# Altium schematic sheet icewerks.SchDoc
size C
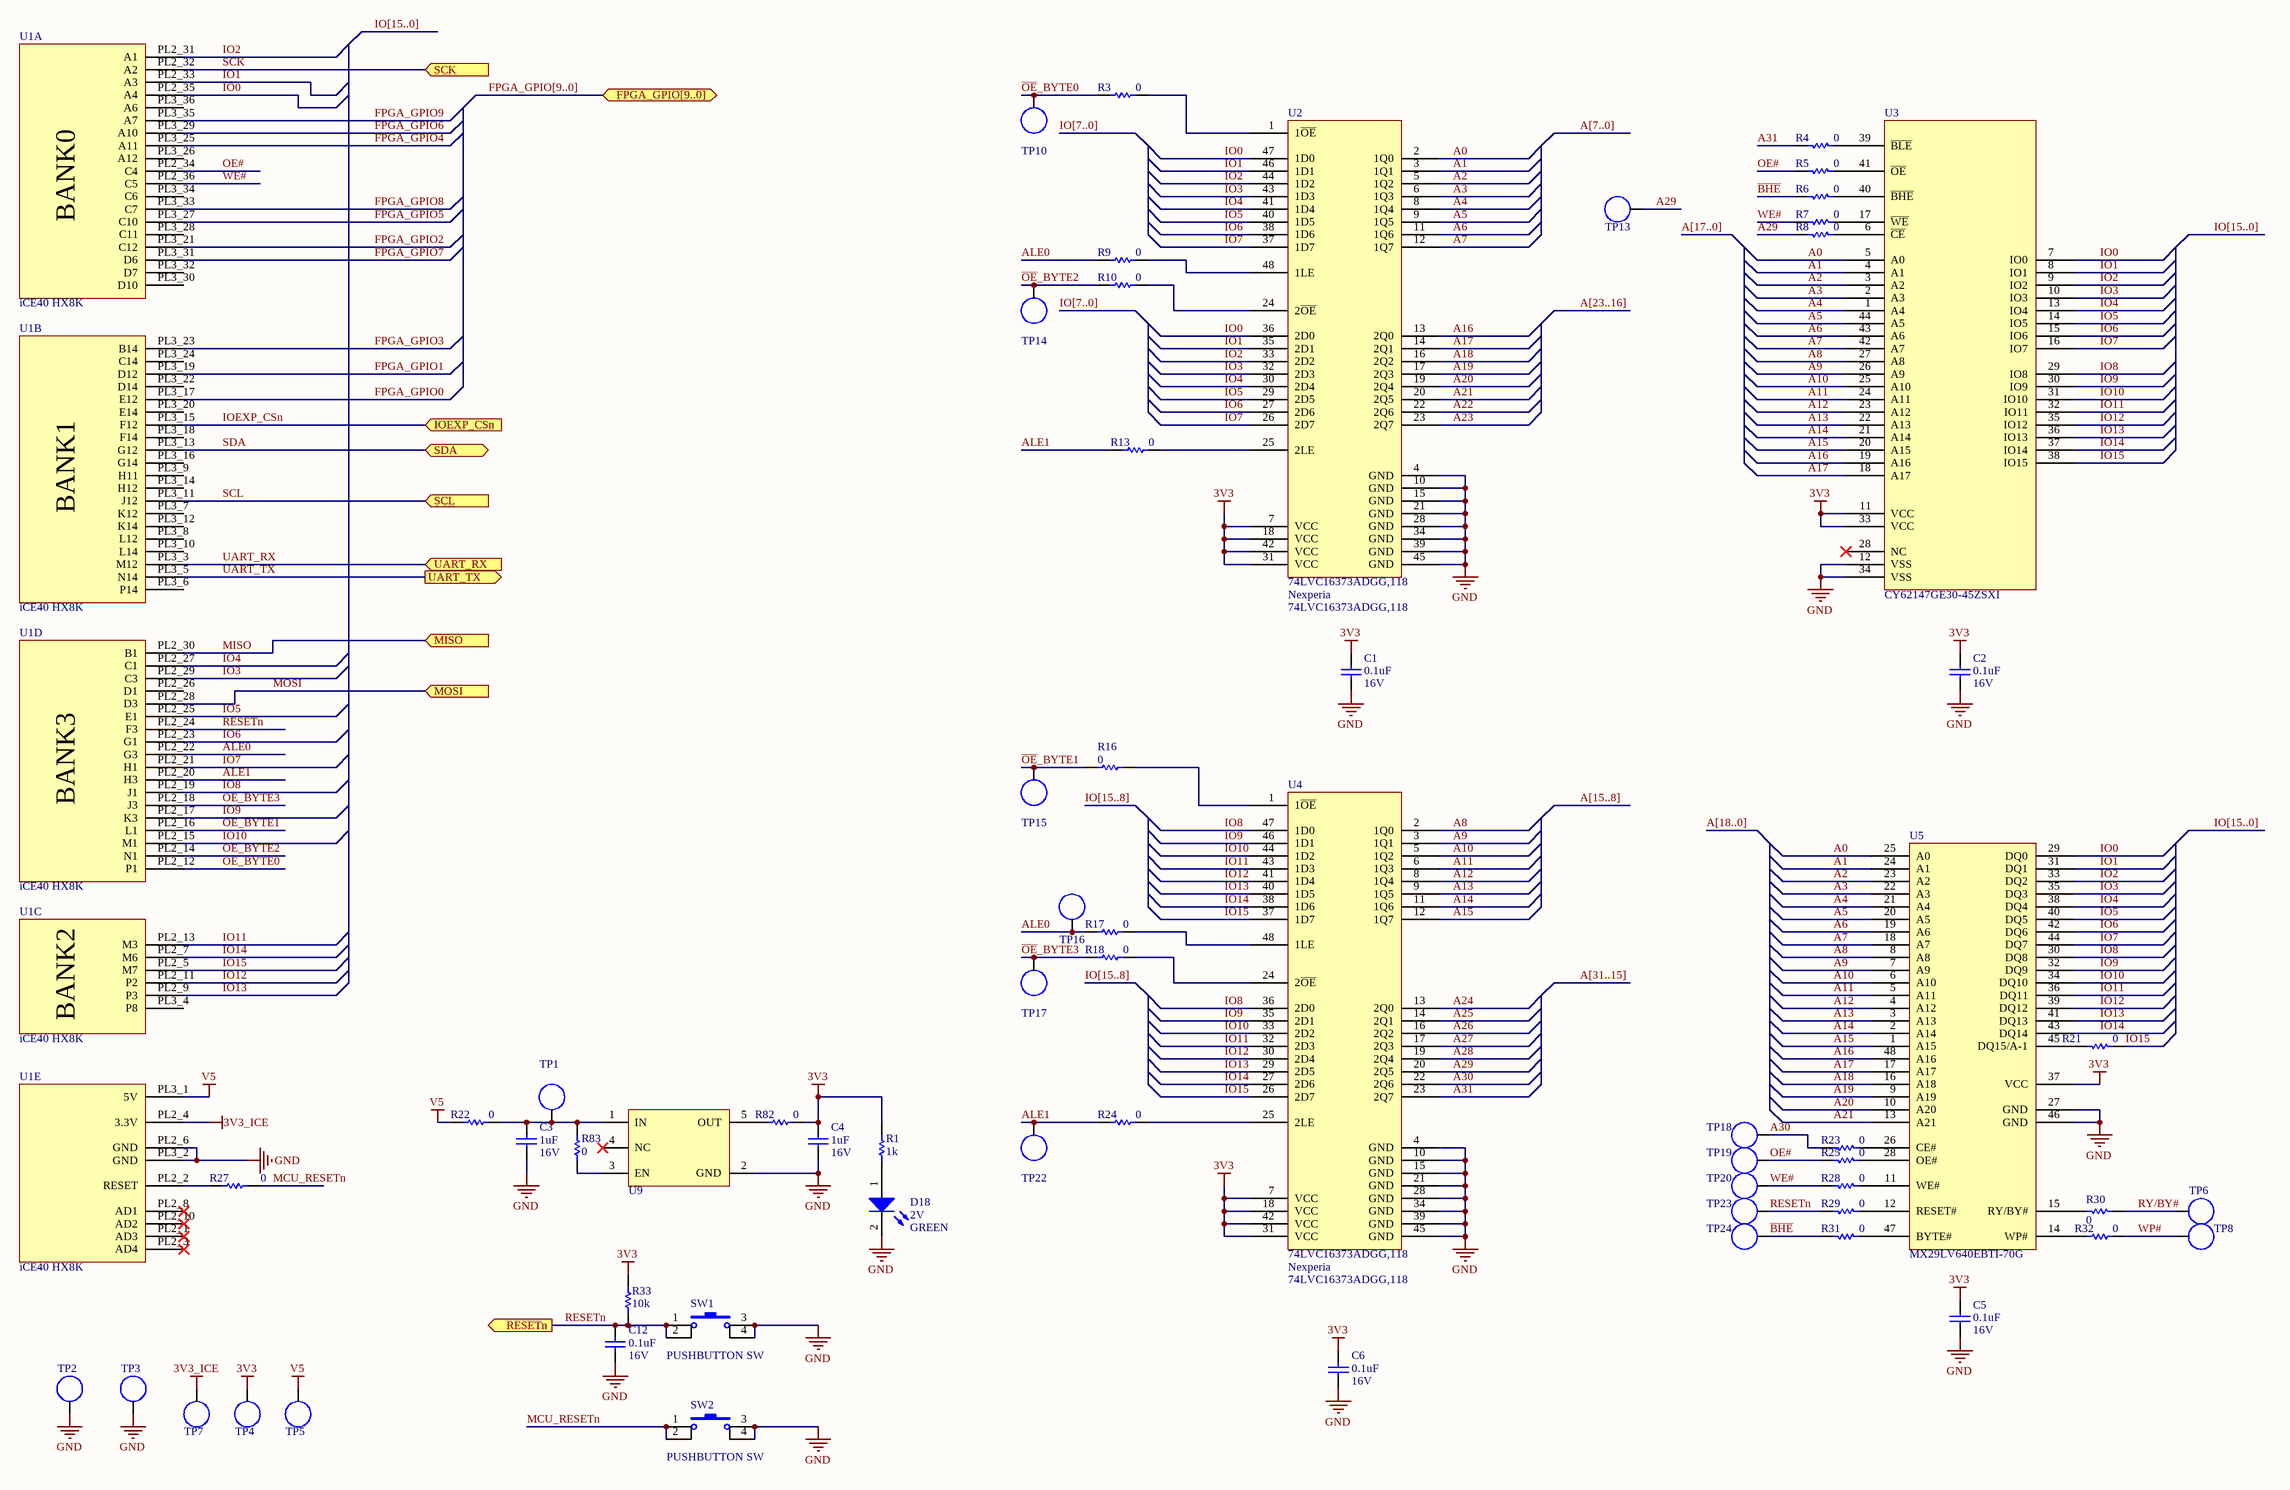
[diagram p0: icewerks.SchDoc]

## Parts
C1  Voltage: 16V  Capacitance: 0.1uF  [0805]  (hidden comment: Cap_NP)
C2  Voltage: 16V  Capacitance: 0.1uF  [0805]  (hidden comment: Cap_NP)
C3  Voltage: 16V  Capacitance: 1uF  [0805]  (hidden comment: Cap_NP)
C4  Voltage: 16V  Capacitance: 1uF  [0805]  (hidden comment: Cap_NP)
C5  Voltage: 16V  Capacitance: 0.1uF  [0805]  (hidden comment: Cap_NP)
C6  Voltage: 16V  Capacitance: 0.1uF  [0805]  (hidden comment: Cap_NP)
C12  Voltage: 16V  Capacitance: 0.1uF  [0805]  (hidden comment: Cap_NP)
D18  Vf: 2V  Color: GREEN  [HSMG-C170]  (hidden comment: LED)
R1  Resistance: 1k  [0805]  (hidden comment: Res)
R3  Resistance: 0  [0805]  (hidden comment: Res)
R4  Resistance: 0  [0805]  (hidden comment: Res)
R5  Resistance: 0  [0805]  (hidden comment: Res)
R6  Resistance: 0  [0805]  (hidden comment: Res)
R7  Resistance: 0  [0805]  (hidden comment: Res)
R8  Resistance: 0  [0805]  (hidden comment: Res)
R9  Resistance: 0  [0805]  (hidden comment: Res)
R10  Resistance: 0  [0805]  (hidden comment: Res)
R13  Resistance: 0  [0805]  (hidden comment: Res)
R16  Resistance: 0  [0805]  (hidden comment: Res)
R17  Resistance: 0  [0805]  (hidden comment: Res)
R18  Resistance: 0  [0805]  (hidden comment: Res)
R21  Resistance: 0  [0805]  (hidden comment: Res)
R22  Resistance: 0  [0805]  (hidden comment: Res)
R23  Resistance: 0  [0805]  (hidden comment: Res)
R24  Resistance: 0  [0805]  (hidden comment: Res)
R25  Resistance: 0  [0805]  (hidden comment: Res)
R27  Resistance: 0  [0805]  (hidden comment: Res)
R28  Resistance: 0  [0805]  (hidden comment: Res)
R29  Resistance: 0  [0805]  (hidden comment: Res)
R30  Resistance: 0  [0805]  (hidden comment: Res)
R31  Resistance: 0  [0805]  (hidden comment: Res)
R32  Resistance: 0  [0805]  (hidden comment: Res)
R33  Resistance: 10k  [0805]  (hidden comment: Res)
R82  Resistance: 0  [0805]  (hidden comment: Res)
R83  Resistance: 0  [0805]  (hidden comment: Res)
SW1  PUSHBUTTON SW  [XKB TS-1187A]
SW2  PUSHBUTTON SW  [XKB TS-1187A]
TP1  TP  [KEYSTONE_5012]  (value not drawn)
TP2  TP  [KEYSTONE_5012]  (value not drawn)
TP3  TP  [KEYSTONE_5012]  (value not drawn)
TP4  TP  [KEYSTONE_5012]  (value not drawn)
TP5  TP  [KEYSTONE_5012]  (value not drawn)
TP6  TP  [KEYSTONE_5012]  (value not drawn)
TP7  TP  [KEYSTONE_5012]  (value not drawn)
TP8  TP  [KEYSTONE_5012]  (value not drawn)
TP10  TP  [KEYSTONE_5012]  (value not drawn)
TP13  TP  [KEYSTONE_5012]  (value not drawn)
TP14  TP  [KEYSTONE_5012]  (value not drawn)
TP15  TP  [KEYSTONE_5012]  (value not drawn)
TP16  TP  [KEYSTONE_5012]  (value not drawn)
TP17  TP  [KEYSTONE_5012]  (value not drawn)
TP18  TP  [KEYSTONE_5012]  (value not drawn)
TP19  TP  [KEYSTONE_5012]  (value not drawn)
TP20  TP  [KEYSTONE_5012]  (value not drawn)
TP22  TP  [KEYSTONE_5012]  (value not drawn)
TP23  TP  [KEYSTONE_5012]  (value not drawn)
TP24  TP  [KEYSTONE_5012]  (value not drawn)
U1  iCE40 HX8K  [iCE40 HX8K FPGA MODULE]  (parts A,B,C,D,E of 5)
U2  74LVC16373ADGG,118  Manufacturer: Nexperia  [NEXPERIA TSSOP-48 (SOT362-1)]
U3  CY62147GE30-45ZSXI  [CYPRESS Z44 44-TSOP II]
U4  74LVC16373ADGG,118  Manufacturer: Nexperia  [NEXPERIA TSSOP-48 (SOT362-1)]
U5  MX29LV640EBTI-70G
U9  TLV73333PDBVR  [TI DBV0005A (SOT23-5)]  (value not drawn)

## Ports
FPGA_GPIO[9..0] (bidir), IOEXP_CSn (in), MISO (in), MOSI (in), RESETn (out), SCK (in), SCL (in), SDA (bidir), UART_RX (in), UART_TX (out)

## Nets
3V3: C1.2 C2.2 C4.2 C5.2 C6.2 R1.2 R33.2 R82.2 TP4.1 U2.7(VCC) U2.18(VCC) U2.31(VCC) U2.42(VCC) U3.11(VCC) U3.33(VCC) U4.7(VCC) U4.18(VCC) U4.31(VCC) U4.42(VCC) U5.37(VCC)
3V3_ICE: TP7.1 U1.PL2_4(3.3V)
GND: C1.1 C2.1 C3.1 C4.1 C5.1 C6.1 C12.1 D18.2(K) SW1.3 SW1.4 SW2.3 SW2.4 TP2.1 TP3.1 U1.PL2_6(GND) U1.PL3_2(GND) U2.4(GND) U2.10(GND) U2.15(GND) U2.21(GND) U2.28(GND) U2.34(GND) U2.39(GND) U2.45(GND) U3.12(VSS) U3.34(VSS) U4.4(GND) U4.10(GND) U4.15(GND) U4.21(GND) U4.28(GND) U4.34(GND) U4.39(GND) U4.45(GND) U5.27(GND) U5.46(GND) U9.2(GND)
V5: R22.1 TP5.1 U1.PL3_1(5V)
A0: U2.2(1Q0) U3.5(A0) U5.25(A0)
A1: U2.3(1Q1) U3.4(A1) U5.24(A1)
A2: U2.5(1Q2) U3.3(A2) U5.23(A2)
A3: U2.6(1Q3) U3.2(A3) U5.22(A3)
A4: U2.8(1Q4) U3.1(A4) U5.21(A4)
A5: U2.9(1Q5) U3.44(A5) U5.20(A5)
A6: U2.11(1Q6) U3.43(A6) U5.19(A6)
A7: U2.12(1Q7) U3.42(A7) U5.18(A7)
A8: U3.27(A8) U4.2(1Q0) U5.8(A8)
A9: U3.26(A9) U4.3(1Q1) U5.7(A9)
A10: U3.25(A10) U4.5(1Q2) U5.6(A10)
A11: U3.24(A11) U4.6(1Q3) U5.5(A11)
A12: U3.23(A12) U4.8(1Q4) U5.4(A12)
A13: U3.22(A13) U4.9(1Q5) U5.3(A13)
A14: U3.21(A14) U4.11(1Q6) U5.2(A14)
A15: U3.20(A15) U4.12(1Q7) U5.1(A15)
A16: U2.13(2Q0) U3.19(A16) U5.48(A16)
A17: U2.14(2Q1) U3.18(A17) U5.17(A17)
A18: U2.16(2Q2) U5.16(A18)
A19: U2.17(2Q3) U5.9(A19)
A20: U2.19(2Q4) U5.10(A20)
A21: U2.20(2Q5) U5.13(A21)
A22: U2.22(2Q6)
A23: U2.23(2Q7)
A24: U4.13(2Q0)
A25: U4.14(2Q1)
A26: U4.16(2Q2)
A27: U4.17(2Q3)
A28: U4.19(2Q4)
A29: R8.2 TP13.1 U4.20(2Q5)
A30: R23.2 TP18.1 U4.22(2Q6)
A31: R4.2 U4.23(2Q7)
ALE0: R9.1 R17.1 TP16.1 U1.PL2_22(G3)
ALE1: R13.1 R24.1 TP22.1 U1.PL2_20(H3)
~{BHE}: R6.2 R31.2 TP24.1
FPGA_GPIO0: U1.PL3_17(E12)
FPGA_GPIO1: U1.PL3_19(D12)
FPGA_GPIO2: U1.PL3_21(C12)
FPGA_GPIO3: U1.PL3_23(B14)
FPGA_GPIO4: U1.PL3_25(A11)
FPGA_GPIO5: U1.PL3_27(C10)
FPGA_GPIO6: U1.PL3_29(A10)
FPGA_GPIO7: U1.PL3_31(D6)
FPGA_GPIO8: U1.PL3_33(C7)
FPGA_GPIO9: U1.PL3_35(A7)
IO0: U1.PL2_35(A4) U2.36(2D0) U2.47(1D0) U3.7(IO0) U5.29(DQ0)
IO1: U1.PL2_33(A3) U2.35(2D1) U2.46(1D1) U3.8(IO1) U5.31(DQ1)
IO2: U1.PL2_31(A1) U2.33(2D2) U2.44(1D2) U3.9(IO2) U5.33(DQ2)
IO3: U1.PL2_29(C3) U2.32(2D3) U2.43(1D3) U3.10(IO3) U5.35(DQ3)
IO4: U1.PL2_27(C1) U2.30(2D4) U2.41(1D4) U3.13(IO4) U5.38(DQ4)
IO5: U1.PL2_25(E1) U2.29(2D5) U2.40(1D5) U3.14(IO5) U5.40(DQ5)
IO6: U1.PL2_23(G1) U2.27(2D6) U2.38(1D6) U3.15(IO6) U5.42(DQ6)
IO7: U1.PL2_21(H1) U2.26(2D7) U2.37(1D7) U3.16(IO7) U5.44(DQ7)
IO8: U1.PL2_19(J1) U3.29(IO8) U4.36(2D0) U4.47(1D0) U5.30(DQ8)
IO9: U1.PL2_17(K3) U3.30(IO9) U4.35(2D1) U4.46(1D1) U5.32(DQ9)
IO10: U1.PL2_15(M1) U3.31(IO10) U4.33(2D2) U4.44(1D2) U5.34(DQ10)
IO11: U1.PL2_13(M3) U3.32(IO11) U4.32(2D3) U4.43(1D3) U5.36(DQ11)
IO12: U1.PL2_11(P2) U3.35(IO12) U4.30(2D4) U4.41(1D4) U5.39(DQ12)
IO13: U1.PL2_9(P3) U3.36(IO13) U4.29(2D5) U4.40(1D5) U5.41(DQ13)
IO14: U1.PL2_7(M6) U3.37(IO14) U4.27(2D6) U4.38(1D6) U5.43(DQ14)
IO15: R21.1 U1.PL2_5(M7) U3.38(IO15) U4.26(2D7) U4.37(1D7)
IOEXP_CSn: U1.PL3_15(F12) ; port IOEXP_CSn
MCU_RESETn: R27.2 SW2.1 SW2.2
MISO: U1.PL2_30(B1) ; port MISO
MOSI: U1.PL2_28(D3) ; port MOSI
~{OE}_BYTE0: R3.1 TP10.1 U1.PL2_12(P1)
~{OE}_BYTE1: R16.1 TP15.1 U1.PL2_16(L1)
~{OE}_BYTE2: R10.1 TP14.1 U1.PL2_14(N1)
~{OE}_BYTE3: R18.1 TP17.1 U1.PL2_18(J3)
OE#: R5.2 R25.2 TP19.1 U1.PL2_34(C4)
RESETn: C12.2 R29.2 R33.1 SW1.1 SW1.2 TP23.1 U1.PL2_24(F3) ; port RESETn
RY/BY#: R30.1 TP6.1
SCK: U1.PL2_32(A2) ; port SCK
SCL: U1.PL3_11(J12) ; port SCL
SDA: U1.PL3_13(G12) ; port SDA
UART_RX: U1.PL3_3(M12) ; port UART_RX
UART_TX: U1.PL3_5(N14) ; port UART_TX
WE#: R7.2 R28.2 TP20.1 U1.PL2_36(C5)
WP#: R32.2 TP8.1
NetC3_2: C3.2 R22.2 R83.2 TP1.1 U9.1(IN)
NetD18_1: D18.1(A) R1.1
NetR3_2: R3.2 U2.1(1~{OE})
NetR4_1: R4.1 U3.39(~{BLE})
NetR5_1: R5.1 U3.41(~{OE})
NetR6_1: R6.1 U3.40(~{BHE})
NetR7_1: R7.1 U3.17(~{WE})
NetR8_1: R8.1 U3.6(~{CE})
NetR9_2: R9.2 U2.48(1LE)
NetR10_2: R10.2 U2.24(2~{OE})
NetR13_2: R13.2 U2.25(2LE)
NetR16_2: R16.2 U4.1(1~{OE})
NetR17_2: R17.2 U4.48(1LE)
NetR18_2: R18.2 U4.24(2~{OE})
NetR21_2: R21.2 U5.45(DQ15/A-1)
NetR23_1: R23.1 U5.26(CE#)
NetR24_2: R24.2 U4.25(2LE)
NetR25_1: R25.1 U5.28(OE#)
NetR27_1: R27.1 U1.PL2_2(RESET)
NetR28_1: R28.1 U5.11(WE#)
NetR29_1: R29.1 U5.12(RESET#)
NetR30_2: R30.2 U5.15(RY/BY#)
NetR31_1: R31.1 U5.47(BYTE#)
NetR32_1: R32.1 U5.14(WP#)
NetR82_1: R82.1 U9.5(OUT)
NetR83_1: R83.1 U9.3(EN)

Not connected (* = marked no-connect by the designer): U1 PL2_1(AD3)* PL2_3(AD4)* PL2_8(AD1)* PL2_10(AD2)* PL2_26(D1) PL3_4(P8) PL3_6(P14) PL3_7(K12) PL3_8(L12) PL3_9(H11) PL3_10(L14) PL3_12(K14) PL3_14(H12) PL3_16(G14) PL3_18(F14) PL3_20(E14) PL3_22(D14) PL3_24(C14) PL3_26(A12) PL3_28(C11) PL3_30(D10) PL3_32(D7) PL3_34(C6) PL3_36(A6); U3 28(NC)*; U9 4(NC)*

## Buses and harness runs
bus A[7..0]
bus A[15..8]
bus A[17..0]
bus A[18..0]
bus A[23..16]
bus A[31..15]
bus FPGA_GPIO[9..0] = port FPGA_GPIO[9..0]
bus IO[7..0]
bus IO[15..0]
bus IO[15..8]

## Notes on the sheet
- (in symbol iCE40 HX8K FPGA MODULE, part A) BANK0
- (in symbol iCE40 HX8K FPGA MODULE, part B) BANK1
- (in symbol iCE40 HX8K FPGA MODULE, part C) BANK2
- (in symbol iCE40 HX8K FPGA MODULE, part D) BANK3

## Library data of the parts
C1 C2 C5 C6 C12 = Cap_NP: Capacitor; Manufacturer PN: C0805C104M4VACTU; Manufacturer: KEMET; Tolerance: *
C3 C4 = Cap_NP: Capacitor; Manufacturer PN: EMK212BJ105MD-T; Manufacturer: Taiyo Yuden; Tolerance: *
D18 = LED: Manufacturer: Broadcom; Manufacturer PN: HSMG-C170
R1 = Res: Resistor; Manufacturer PN: RMCF0805JT1K00; Manufacturer: Stackpole Electronics Inc; Tolerance: 5%; Power Rating: 1/8W
R3-R10 R13 R16-R18 R21-R25 R27-R32 R82 R83 = Res: Resistor; Manufacturer PN: RMCF0805ZT0R00; Manufacturer: Stackpole Electronics Inc; Tolerance: Jumper; Power Rating: 1/10W
R33 = Res: Resistor; Manufacturer PN: RMCF0805JT10K0; Manufacturer: Stackpole Electronics Inc; Tolerance: 5%; Power Rating: 1/8W
SW1 SW2 = SWITCH_PB: Manufacturer PN: TS-1187A-C-E-B; Manufacturer: XKB
TP1-TP8 TP10 TP13-TP20 TP22-TP24 = TP: Manufacturer PN: 5015; Manufacturer: Keystone
U1 = iCE40 HX8K FPGA MODULE: Manufacturer: Samtec; Manufacturer PN: SQW-118-01-L-D
U2 U4 = 74LVC16373ADGG,118: D-Type Transparent Latch 2 Channel 8:8 IC Tri-State 48-TSSOP; Manufacturer PN: 74LVC16373ADGG,118
U3 = CY62147GE30-45ZSXI: SRAM - Asynchronous Memory IC 4Mb (256K x 16) Parallel 45ns 44-TSOP II; Manufacturer: Cypress; Manufacturer PN: CY62147GE30-45ZSXI
U5 = MX29LV640EBTI-70G: FLASH - NOR Memory IC 8Mb (1M x 8, 512K x 16) Parallel  70ns 48-TSOP; Manufacturer: Macronix; Manufacturer PN: MX29LV640EBTI-70G
U9 = TLV73333PDBVR: Manufacturer: Texas Instruments; Manufacturer PN: TLV73333PDBVR